# EAGLE schematic C1_MotorInterface (EAGLE 6.4)
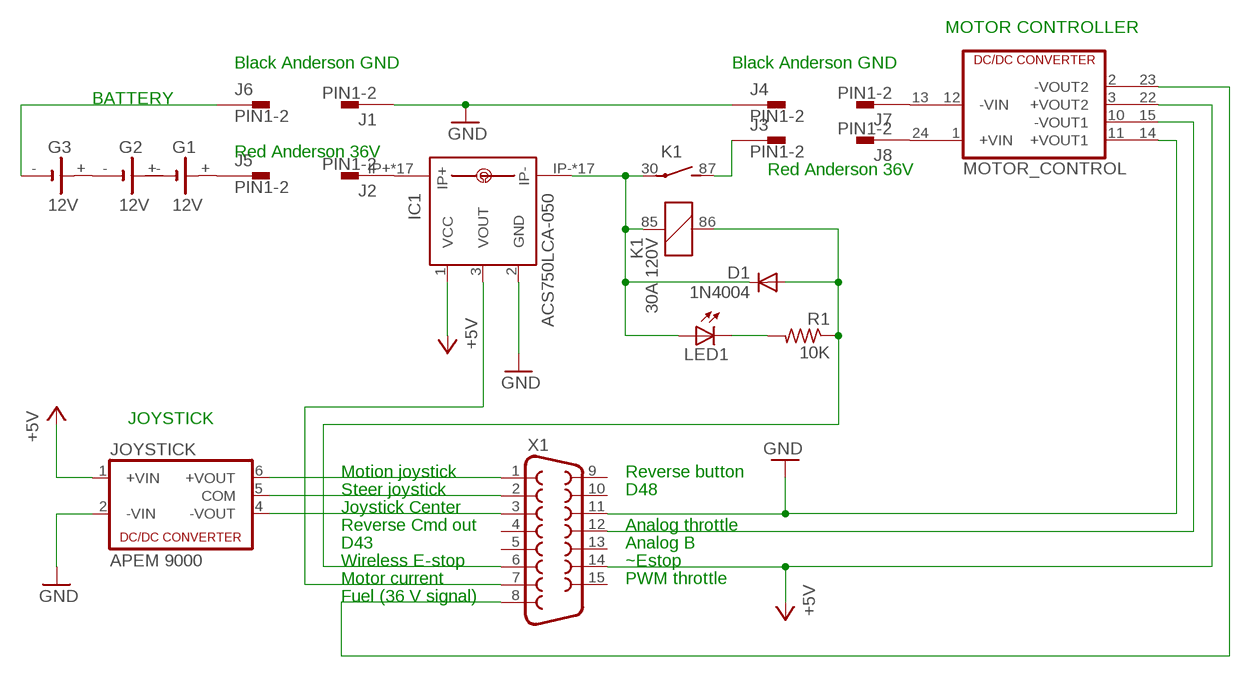
[diagram p0: schematic, sheet 1]

## Parts
D1  1N4004  [DO41-10]
G1  12V  SL-150-1/2AA/PR  [SL-150-1/2AA/PR]
G2  12V  SL-150-1/2AA/PR  [SL-150-1/2AA/PR]
G3  12V  SL-150-1/2AA/PR  [SL-150-1/2AA/PR]
IC1  ACS750LCA-050  [ACS75050]
J1  PIN1-2  [62221]
J2  PIN1-2  [62221]
J3  PIN1-2  [62221]
J4  PIN1-2  [62221]
J5  PIN1-2  [62221]
J6  PIN1-2  [62221]
J7  PIN1-2  [62221]
J8  PIN1-2  [62221]
JOYSTICK  APEM 9000  DIW2  [DIW2]
K1  30A 120V  CM1A-P-24V  [CM]
LED1  LED3MM  [LED3MM]
MOTOR_CONTROL  DCW2U  [DCW]
R1  10K  R-US_0204/5  [0204/5]
X1  F15H  [F15H]

## Nets
+5V: IC1.1(VCC) JOYSTICK.1(+VIN) MOTOR_CONTROL.22(+VOUT) X1.14
GND: IC1.2(GND) J1.1 J4.1 JOYSTICK.2(-VIN) MOTOR_CONTROL.14(+VOUT) X1.11
N$1: D1.C IC1.IP- IC1.IP-@2(IP-) IC1.IP-@3(IP-) IC1.IP-@4(IP-) IC1.IP-@5(IP-) IC1.IP-@6(IP-) IC1.IP-@7(IP-) IC1.IP-@8(IP-) IC1.IP-@9(IP-) IC1.IP-@10(IP-) IC1.IP-@11(IP-) IC1.IP-@12(IP-) IC1.IP-@13(IP-) IC1.IP-@14(IP-) IC1.IP-@15(IP-) IC1.IP-@16(IP-) IC1.IP-@17(IP-) K1.30(2:P) K1.85 LED1.A
N$2: J7.1 MOTOR_CONTROL.13(-VIN1)
N$3: IC1.3(VOUT) X1.7
N$4: LED1.K(C) R1.2
N$5: MOTOR_CONTROL.23(-VOUT) X1.8
N$6: J3.1 K1.87(2:S)
N$7: G2.- G3.+
N$8: G3.-
N$9: J8.1 MOTOR_CONTROL.24(+VIN1)
N$10: D1.A K1.86 R1.1 X1.6
N$11: MOTOR_CONTROL.15(-VOUT) X1.12
N$12: IC1.IP+ IC1.IP+@2(IP+) IC1.IP+@3(IP+) IC1.IP+@4(IP+) IC1.IP+@5(IP+) IC1.IP+@6(IP+) IC1.IP+@7(IP+) IC1.IP+@8(IP+) IC1.IP+@9(IP+) IC1.IP+@10(IP+) IC1.IP+@11(IP+) IC1.IP+@12(IP+) IC1.IP+@13(IP+) IC1.IP+@14(IP+) IC1.IP+@15(IP+) IC1.IP+@16(IP+) IC1.IP+@17(IP+) J2.1
N$13: JOYSTICK.6(+VOUT) X1.1
N$14: JOYSTICK.5(COM) X1.2
N$15: JOYSTICK.4(-VOUT) X1.3
Unconnected: G1.+ G1.- G2.+ J5.1 J6.1 MOTOR_CONTROL.1(+VIN) MOTOR_CONTROL.2(-VOUT2) MOTOR_CONTROL.3(+VOUT2) MOTOR_CONTROL.10(-VOUT1) MOTOR_CONTROL.11(+VOUT1) MOTOR_CONTROL.12(-VIN) X1.4 X1.5 X1.9 X1.10 X1.13 X1.15

## Notes on the sheet
- MOTOR CONTROLLER
- Black Anderson GND | Black Anderson GND
- BATTERY
- Red Anderson 36V
- Red Anderson 36V
- JOYSTICK
- Motion joystick | Reverse button
- Steer joystick | D48
- Joystick Center
- Reverse Cmd out | Analog throttle
- D43 | Analog B
- Wireless E-stop | ~Estop
- Motor current | PWM throttle
- Fuel (36 V signal)

## Library data of the parts
D1 = diode:1N4004: DIODE general purpose rectifier, 1 A
G1-G3 = battery:SL-150-1/2AA/PR: LI BATTERY Sonnenschein
IC1 = allegro:ACS750*CA-050: Current Sensor display layer 49 Reference in BRD and place VIAs on circles Source: www.allegromicro.com/datafile/0750-050.pdf; MF: ALLEGRO MICROSYSTEMS, INC.; MPN: ACS750LCA-050; OC_FARNELL: 1457176; OC_NEWARK: 61H4464
J1-J8 = con-faston:PIN1-2: CONN TAB FASTON BRASS .187 PCB TAB, FSSTON, DUAL STAKE, .187 SERIES Digi-Key Part Number: A24734CT-ND Source: Tyco Electronics Corporation .. ENG_CD_62221_R.pdf http://search.digikey.com/scripts/DkSearch/dksus.dll?Detail&name=A24734CT-ND; MF: TYCO ELECTRONICS; MPN: 62221-1; OC_FARNELL: unknown; OC_NEWARK: 16H2318
JOYSTICK = dc-dc-converter:DIW2: DC-DC CONVERTER; OC_FARNELL: unknown; OC_NEWARK: unknown
K1 = relay:CM1A*: AUTOMOTIVE MICRO-ISO RELAY NAiS en_ds_61204_0000.pdf; OC_FARNELL: unknown; OC_NEWARK: unknown
LED1 = led:LED: LED OSRAM: - CHIPLED LG R971, LG N971, LY N971, LG Q971, LY Q971, LO R971, LY R971 LH N974, LH R974 LS Q976, LO Q976, LY Q976 LO Q996 - Hyper CHIPLED LW Q18S LB Q993, LB Q99A, LB R99A - SideLED LS A670, LO A670, LY A670, LG A670, LP A670 LB A673, LV A673, LT A673, LW A673 LH A674 LY A675 LS A676, LA A676, LO A676, LY A676, LW A676 LS A679, LY A679, LG A679 - Hyper Micro SIDELED® LS Y876, LA Y876, LO Y876, LY Y876 LT Y87S - SmartLED LW L88C, LW L88S LB L89C, LB L89S, LG L890 LS L89K, LO L89K, LY L89K LS L896, LA L896, LO L896, LY L896 - TOPLED LS T670, LO T670, LY T670, LG T670, LP T670 LSG T670, LSP T670, LSY T670, LOP T670, LYG T670 LG T671, LOG T671, LSG T671 LB T673, LV T673, LT T673, LW T673 LH T674 LS T676, LA T676, LO T676, LY T676, LB T676, LH T676, LSB T676, LW T676 LB T67C, LV T67C, LT T67C, LS T67K, LO T67K, LY T67K, LW E67C LS E67B, LA E67B, LO E67B, LY E67B, LB E67C, LV E67C, LT E67C LW T67C LS T679, LY T679, LG T679 LS T770, LO T770, LY T770, LG T770, LP T770 LB T773, LV T773, LT T773, LW T773 LH T774 LS E675, LA E675, LY E675, LS T675 LS T776, LA T776, LO T776, LY T776, LB T776 LHGB T686 LT T68C, LB T68C - Hyper Mini TOPLED® LB M676 - Mini TOPLED Santana® LG M470 LS M47K, LO M47K, LY M47K Source: http://www.osram.convergy.de LUXEON: - LUMILED® LXK2-PW12-R00, LXK2-PW12-S00, LXK2-PW14-U00, LXK2-PW14-V00 LXK2-PM12-R00, LXK2-PM12-S00, LXK2-PM14-U00 LXK2-PE12-Q00, LXK2-PE12-R00, LXK2-PE12-S00, LXK2-PE14-T00, LXK2-PE14-U00 LXK2-PB12-K00, LXK2-PB12-L00, LXK2-PB12-M00, LXK2-PB14-N00, LXK2-PB14-P00, LXK2-PB14-Q00 LXK2-PR12-L00, LXK2-PR12-M00, LXK2-PR14-Q00, LXK2-PR14-R00 LXK2-PD12-Q00, LXK2-PD12-R00, LXK2-PD12-S00 LXK2-PH12-R00, LXK2-PH12-S00 LXK2-PL12-P00, LXK2-PL12-Q00, LXK2-PL12-R00 Source: www.luxeon.com KINGBRIGHT: KA-3528ASYC Source: www.kingbright.com
MOTOR_CONTROL = dc-dc-converter:DCW2U: DC-DC CONVERTER; OC_FARNELL: unknown; OC_NEWARK: unknown
R1 = rcl:R-US_: RESISTOR, American symbol
X1 = con-subd:F15: SUB-D; OC_FARNELL: unknown; OC_NEWARK: unknown